# Altium schematic sheet CONNECTOR_INTERFACE.SchDoc
size 420 x 297 mm; SheetNumber: 14; SheetTotal: 20
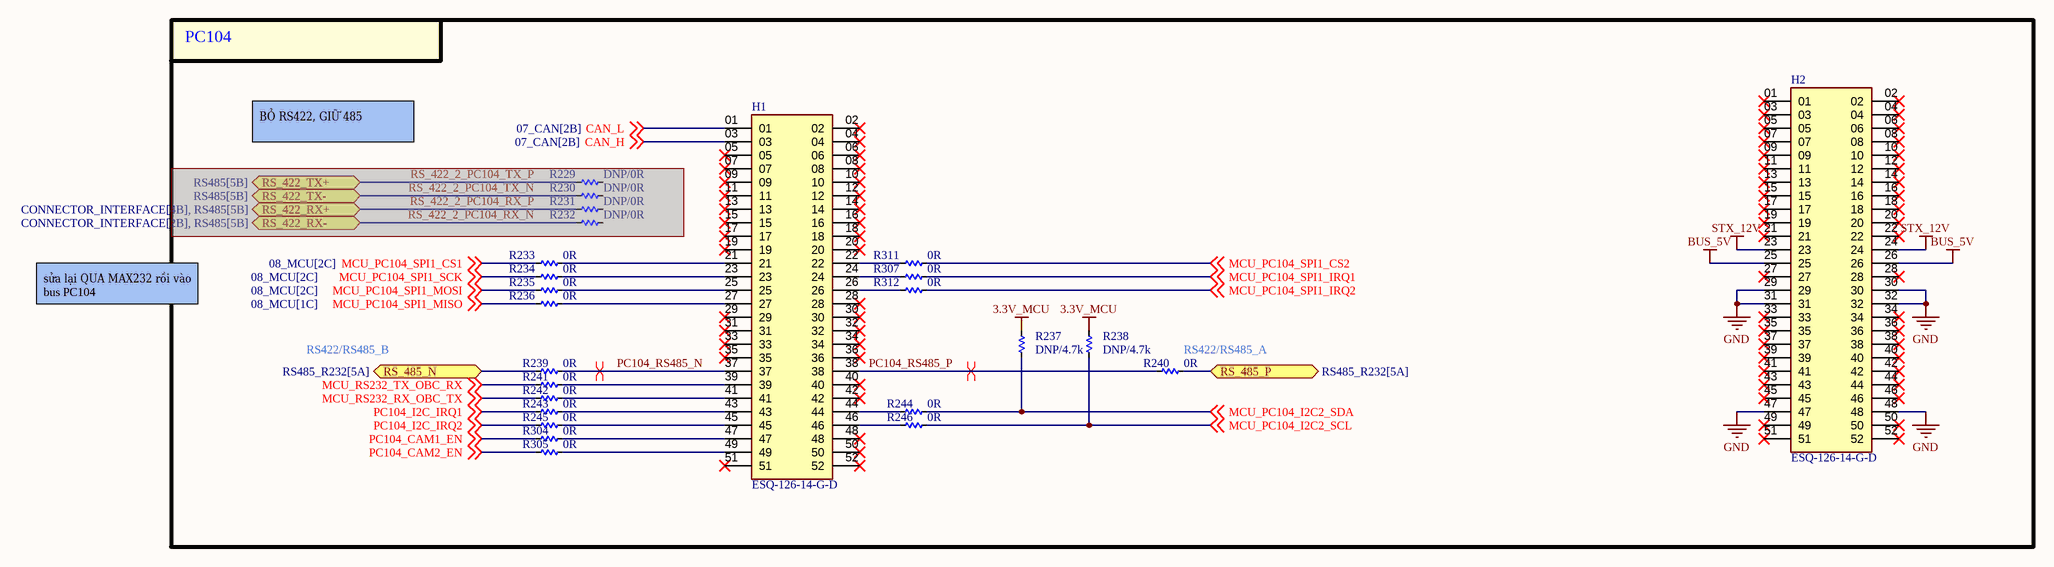
[diagram p0: CONNECTOR_INTERFACE.SchDoc]

## Parts
H1  ESQ-126-14-G-D  [SAMTEC_ESQ-126-14-G-D]
H2  ESQ-126-14-G-D  [SAMTEC_ESQ-126-14-G-D]
R229  DNP/0R  [RES_C_1005x30_L]  (masked out: inside a compile mask, not in the netlist)
R230  DNP/0R  [RES_C_1005x30_L]  (masked out: inside a compile mask, not in the netlist)
R231  DNP/0R  [RES_C_1005x30_L]  (masked out: inside a compile mask, not in the netlist)
R232  DNP/0R  [RES_C_1005x30_L]  (masked out: inside a compile mask, not in the netlist)
R233  0R  [RES_C_1005x30_L]
R234  0R  [RES_C_1005x30_L]
R235  0R  [RES_C_1005x30_L]
R236  0R  [RES_C_1005x30_L]
R237  DNP/4.7k  [RES_C_1005x30_L]
R238  DNP/4.7k  [RES_C_1005x30_L]
R239  0R  [RES_C_1005x30_L]
R240  0R  [RES_C_1005x30_L]
R241  0R  [RES_C_1005x30_L]
R242  0R  [RES_C_1005x30_L]
R243  0R  [RES_C_1005x30_L]
R244  0R  [RES_C_1005x30_L]
R245  0R  [RES_C_1005x30_L]
R246  0R  [RES_C_1005x30_L]
R304  0R  [RES_C_1005x30_L]
R305  0R  [RES_C_1005x30_L]
R307  0R  [RES_C_1005x30_L]
R311  0R  [RES_C_1005x30_L]
R312  0R  [RES_C_1005x30_L]

## Ports
RS_422_RX+ (bidir, see CONNECTOR_INTERFACE[4B], RS485[5B]), RS_422_RX- (bidir, see CONNECTOR_INTERFACE[2B], RS485[5B]), RS_422_TX+ (bidir, see RS485[5B]), RS_422_TX- (bidir, see RS485[5B]), RS_485_N (bidir, see RS485_R232[5A]), RS_485_P (bidir, see RS485_R232[5A])

## Nets
3.3V_MCU: R237.2 R238.2
BUS_5V: H2.25 H2.26
GND: H2.29 H2.30 H2.31 H2.32 H2.47 H2.48
STX_12V: H2.23 H2.24
CAN_H: H1.03 ; off-sheet CAN_H
CAN_L: H1.01 ; off-sheet CAN_L
MCU_PC104_I2C2_SCL: R238.1 R246.2 ; off-sheet MCU_PC104_I2C2_SCL
MCU_PC104_I2C2_SDA: R237.1 R244.2 ; off-sheet MCU_PC104_I2C2_SDA
MCU_PC104_SPI1_CS1: R233.1 ; off-sheet MCU_PC104_SPI1_CS1
MCU_PC104_SPI1_CS2: R311.1 ; off-sheet MCU_PC104_SPI1_CS2
MCU_PC104_SPI1_IRQ1: R307.2 ; off-sheet MCU_PC104_SPI1_IRQ1
MCU_PC104_SPI1_IRQ2: R312.2 ; off-sheet MCU_PC104_SPI1_IRQ2
MCU_PC104_SPI1_MISO: R236.1 ; off-sheet MCU_PC104_SPI1_MISO
MCU_PC104_SPI1_MOSI: R235.1 ; off-sheet MCU_PC104_SPI1_MOSI
MCU_PC104_SPI1_SCK: R234.1 ; off-sheet MCU_PC104_SPI1_SCK
MCU_RS232_RX_OBC_TX: R242.1 ; off-sheet MCU_RS232_RX_OBC_TX
MCU_RS232_TX_OBC_RX: R241.1 ; off-sheet MCU_RS232_TX_OBC_RX
PC104_CAM1_EN: R304.1 ; off-sheet PC104_CAM1_EN
PC104_CAM2_EN: R305.1 ; off-sheet PC104_CAM2_EN
PC104_I2C_IRQ1: R243.1 ; off-sheet PC104_I2C_IRQ1
PC104_I2C_IRQ2: R245.1 ; off-sheet PC104_I2C_IRQ2
PC104_RS485_N: H1.37 R239.2
PC104_RS485_P: H1.38 R240.1
RS_485_N: R239.1 ; port RS_485_N
RS_485_P: R240.2 ; port RS_485_P
NetH1_21: H1.21 R233.2
NetH1_22: H1.22 R311.2
NetH1_23: H1.23 R234.2
NetH1_24: H1.24 R307.1
NetH1_25: H1.25 R235.2
NetH1_26: H1.26 R312.1
NetH1_27: H1.27 R236.2
NetH1_39: H1.39 R241.2
NetH1_41: H1.41 R242.2
NetH1_43: H1.43 R243.2
NetH1_44: H1.44 R244.1
NetH1_45: H1.45 R245.2
NetH1_46: H1.46 R246.1
NetH1_47: H1.47 R304.2
NetH1_49: H1.49 R305.2

Not connected (* = marked no-connect by the designer): H1 02* 04* 05* 06* 07* 08* 09* 10* 11* 12* 13* 14* 15* 16* 17* 18* 19* 20* 28* 29* 30* 31* 32* 33* 34* 35* 36* 40* 42* 48* 50* 51* 52*; H2 01* 02* 03* 04* 05* 06* 07* 08* 09* 10* 11* 12* 13* 14* 15* 16* 17* 18* 19* 20* 21* 22* 27* 28* 33* 34* 35* 36* 37* 38* 39* 40* 41* 42* 43* 44* 45* 46* 49* 50* 51* 52*

## Layout directives
differential pair: PC104_RS485_N, PC104_RS485_P

## Notes on the sheet
- PC104
- BỎ RS422, GIỮ 485
- sửa lại QUA MAX232 rồi vào bus PC104
- RS422/RS485_B
- (near R240) RS422/RS485_A
- Project:
- Sub-system:
- Design by:
- Sheet title:
- Sheet
- A3
- of
- Checked by:
- Approved by:
- Revision:
- Document No:
- Size:
- Date:

## Library data of the parts
H1 H2 = ESQ-126-14-G-D: CONN SOCKET 52POS 0.1 GOLD PCB; MF: Samtec; MP: ESQ-126-14-G-D; Price: None; Package: None; Value: *; Availability: Unavailable
R229-R246 R304 R305 R307 R311 R312 = _RES_B_2: RES